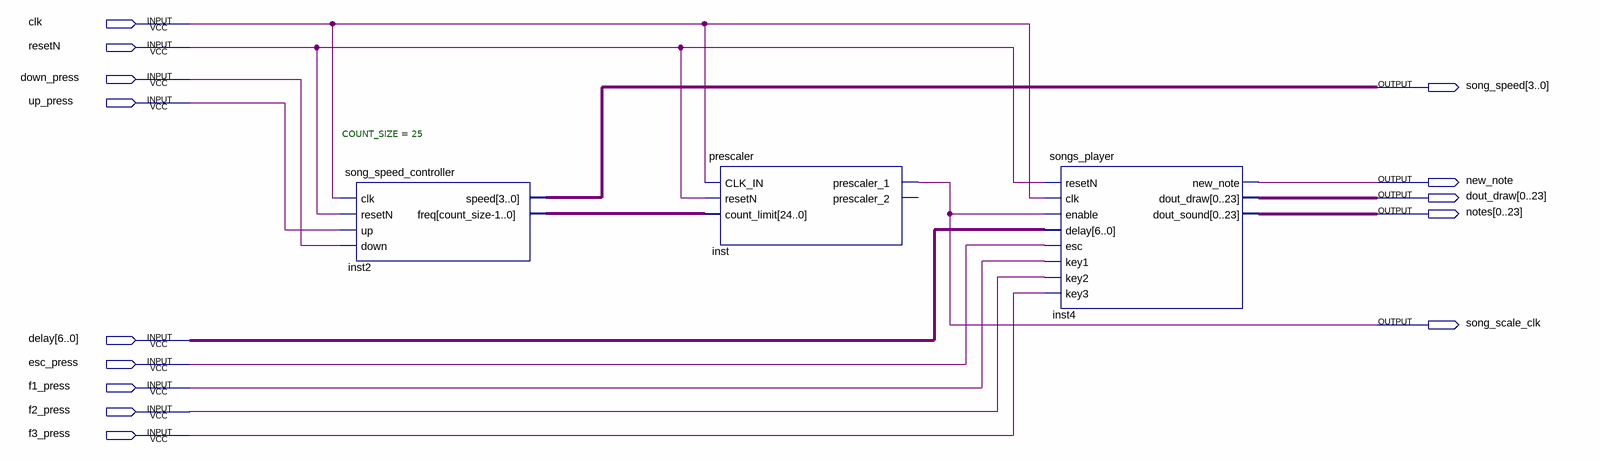
[diagram p0: schematic sheet]
// Quartus schematic song_manager.bdf as structural Verilog: 3 symbols, 14 pins
module song_manager (
  input  clk,
  input  resetN,
  input  down_press,
  input  up_press,
  input  [6:0] delay,
  input  esc_press,
  input  f1_press,
  input  f2_press,
  input  f3_press,
  output [3:0] song_speed,
  output new_note,
  output [0:23] dout_draw,
  output [0:23] notes,
  output song_scale_clk
);

  wire [24:0] inst2_freq;

  song_speed_controller #(.COUNT_SIZE(25)) inst2 (
    .clk(clk), .resetN(resetN), .up(up_press), .down(down_press), .speed(song_speed), .freq(inst2_freq));
  prescaler inst (
    .CLK_IN(clk), .resetN(resetN), .count_limit(inst2_freq), .prescaler_1(song_scale_clk));  // open: prescaler_2
  songs_player inst4 (
    .resetN(resetN), .clk(clk), .enable(song_scale_clk), .delay(delay), .esc(esc_press), .key1(f1_press),
    .key2(f2_press), .key3(f3_press), .new_note(new_note), .dout_draw(dout_draw), .dout_sound(notes));
endmodule
